# Altium schematic sheet SHDN-S07-V00-CAN.SchDoc: CANBUS Interface
size A3; DrawnBy: Jonn Dillon; DocumentNumber: 6; Revision: 01; SheetNumber: 6; SheetTotal: 11; Version: 01; Project: Shutdown Board 2020; PageSetup: Record=PageOptions|CenterHorizontal=True|CenterVertical=True|PrintScale=0.97|XCorrection=1.00|YCorrection=1.00|PrintKind=0|BorderSize=5000000|LeftOffset=0|BottomOffset=0|Orientation=2|PaperLength=1000|PaperWidth=1000|Scale=100|PaperSource=7|PrintQuality=-4|MediaType=1|DitherType=10|PaperKind=A4|PrintScaleMode=1
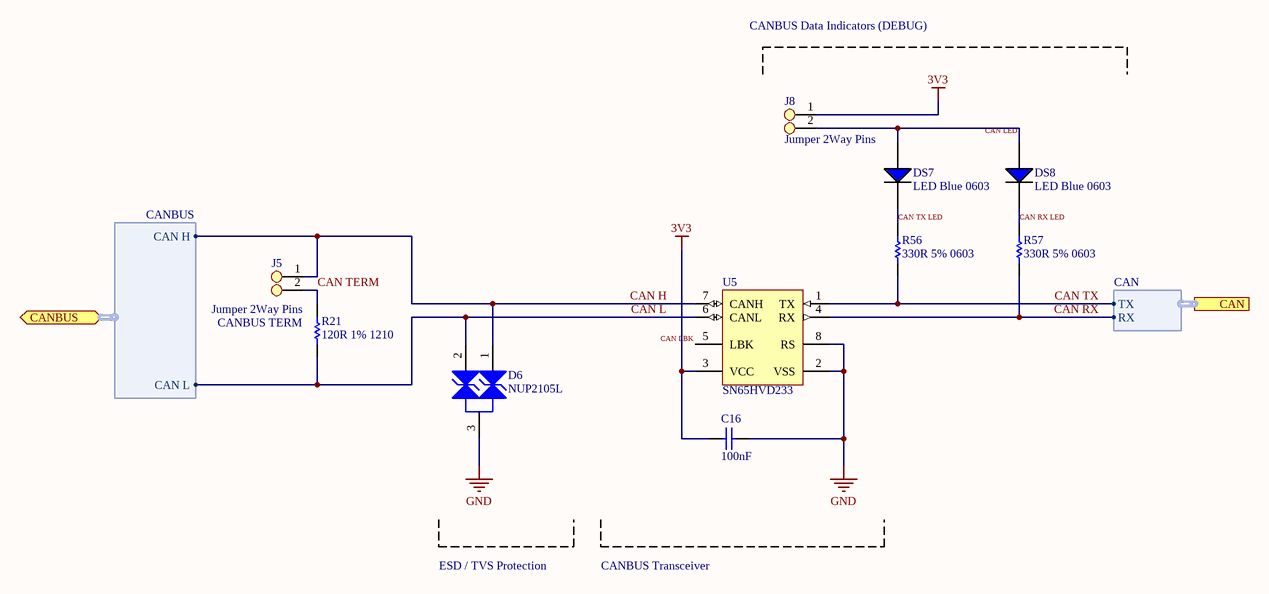
[diagram p0: SHDN-S07-V00-CAN.SchDoc]

## Parts
C16  100nF  [Cap_Ceramic_0603]
D6  NUP2105L  [NUP2105L]
DS7  LED Blue 0603  [LED BLUE 0603]
DS8  LED Blue 0603  [LED BLUE 0603]
J5  Jumper 2Way Pins  [Jumper_2Way_Pin]
J8  Jumper 2Way Pins  [Jumper_2Way_Pin]
R21  120R 1% 1210  [Res_ThinFilm_1210]
R56  330R 5% 0603  [Res_ThinFilm_0603]
R57  330R 5% 0603  [Res_ThinFilm_0603]
U5  SN65HVD233  [SN65HVD233DR]

## Ports
CAN (harness CAN), CANBUS (bidir, harness CANBUS)

## Harnesses
CANBUS: CAN H, CAN L
CAN: RX, TX

## Nets
3V3: C16.2 J8.1 U5.3(VCC)
GND: C16.1 D6.3 U5.2(VSS) U5.8(RS)
CAN H: D6.1 J5.1 U5.7(CANH) ; port CANBUS.CAN H
CAN L: D6.2 R21.1 U5.6(CANL) ; port CANBUS.CAN L
CAN LBK: U5.5(LBK)
CAN LED: DS7.1(A) DS8.1(A) J8.2
CAN RX: R57.1 U5.4(RX) ; port CAN.RX
CAN RX LED: DS8.2(C) R57.2
CAN TERM: J5.2 R21.2
CAN TX: R56.1 U5.1(TX) ; port CAN.TX
CAN TX LED: DS7.2(C) R56.2

## Notes on the sheet
- CANBUS Data Indicators (DEBUG)
- (near R21) CANBUS TERM
- ESD / TVS Protection
- CANBUS Transceiver
- Revision History:
- Sheet Title:
- Rev
- Date
- Description
- Project:
- Size:
- Drawn By:
- A3
- Number:
- Revision:
- Sheet
- Version:
- of
- QUT Motorsport
- O-120, Gardens Point
- 2 George Street
- Brisbane, QLD 4000
- Australia
- Print Date:
- Print Time:
- File Name:

## Library data of the parts
C16 = 100nF 50V 5% X7R 0603: Capacitor, Ceramic, SMD, 100nF, 50V, 5%, X7R, 0603
J5 J8 = Jumper 2Way Side Pins
R21 = 120R 1% 1210: Resistor, SMD, 120R, 0.25W, 1%, 1210
R56 R57 = 330R 5% 0603: Resistor, SMD, 330R, 0.1W, 5%, 0603
D6 = NUP2105L: ComponentLink1Description: Datasheet; ComponentLink1URL: https://www.onsemi.cn/PowerSolutions/document/NUP2105L-D.PDF; Parameter 1: *; ComponentLink2Description: LCSC; ComponentLink2URL: https://lcsc.com/product-detail/TVS_ON-Semiconductor-NUP2105LT1G_C14486.html; ComponentLink3Description: Digikey; ComponentLink3URL: https://www.digikey.com.au/product-detail/en/on-semiconductor/SZNUP2105LT1G/SZNUP2105LT1GOSCT-ND/3487669
U5 = SN65HVD233: ComponentLink1Description: LCSC; ComponentLink1URL: https://lcsc.com/product-detail/CAN-ICs_Texas-Instruments_SN65HVD233DRG4_Texas-Instruments-Texas-Instruments-SN65HVD233DRG4_C61643.html; ComponentLink2Description: Digikey; ComponentLink2URL: https://www.digikey.com.au/product-detail/en/texas-instruments/SN65HVD233DR/296-35967-1-ND/4134960; ComponentLink3Description: Datasheet; ComponentLink3URL: https://www.ti.com/lit/ds/symlink/sn65hvd233.pdf?ts=1588560888178; ComponentLink4Description: Ti Product Page; ComponentLink4URL: https://www.ti.com/product/SN65HVD233